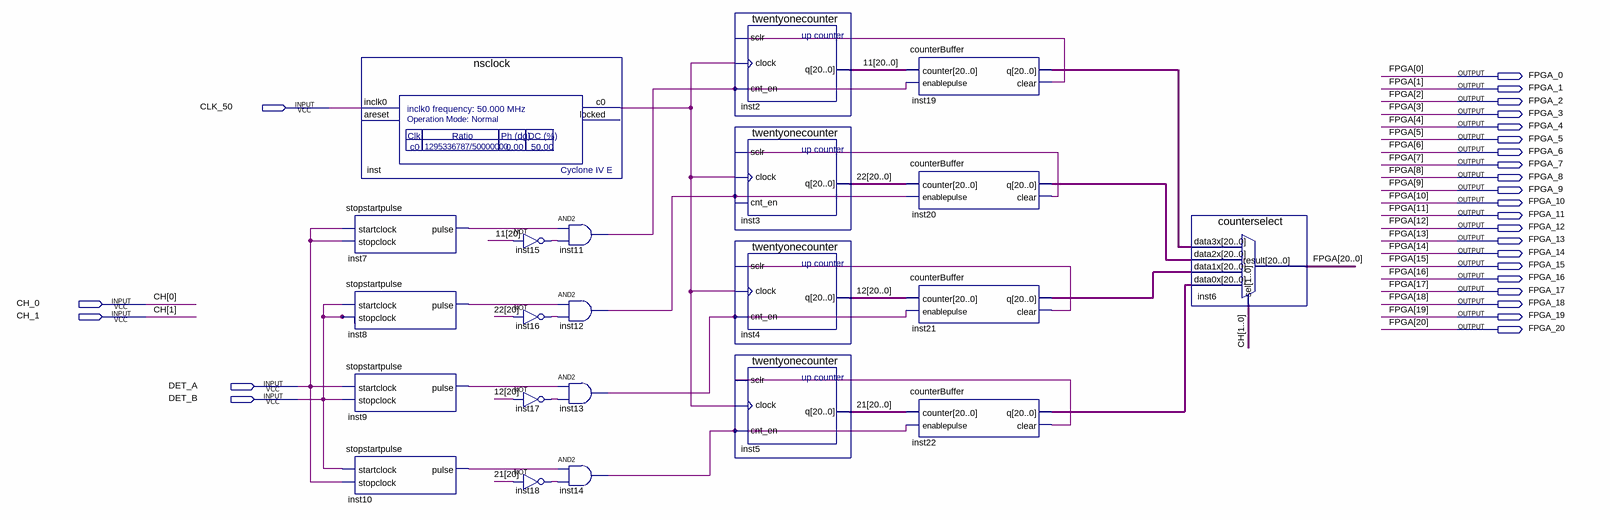
[diagram p0: schematic sheet]
// Quartus schematic timedifferencehist.bdf as structural Verilog: 22 symbols, 26 pins
module timedifferencehist (
  input  CLK_50,
  input  CH_0,
  input  CH_1,
  input  DET_A,
  input  DET_B,
  output FPGA_0,
  output FPGA_1,
  output FPGA_2,
  output FPGA_3,
  output FPGA_4,
  output FPGA_5,
  output FPGA_6,
  output FPGA_7,
  output FPGA_8,
  output FPGA_9,
  output FPGA_10,
  output FPGA_11,
  output FPGA_12,
  output FPGA_13,
  output FPGA_14,
  output FPGA_15,
  output FPGA_16,
  output FPGA_17,
  output FPGA_18,
  output FPGA_19,
  output FPGA_20
);

  wire inst7_pulse, inst8_pulse, inst9_pulse, inst10_pulse, inst11_out, inst12_out, inst13_out, inst14_out,
       inst15_out, inst16_out, inst17_out, inst18_out, inst19_clear, inst20_clear, inst21_clear,
       inst22_clear, inst_c0;
  wire [20:0] \11 , \12 , \21 , \22 , inst19_q, inst20_q, inst21_q, inst22_q;

  nsclock inst (.inclk0(CLK_50), .c0(inst_c0));  // open: areset, locked
  stopstartpulse inst7 (.startclock(DET_A), .stopclock(DET_A), .pulse(inst7_pulse));
  stopstartpulse inst8 (.startclock(DET_B), .stopclock(DET_B), .pulse(inst8_pulse));
  stopstartpulse inst9 (.startclock(DET_A), .stopclock(DET_B), .pulse(inst9_pulse));
  stopstartpulse inst10 (.startclock(DET_B), .stopclock(DET_A), .pulse(inst10_pulse));
  not inst15 (inst15_out, \11 [20]);
  not inst16 (inst16_out, \22 [20]);
  not inst17 (inst17_out, \12 [20]);
  not inst18 (inst18_out, \21 [20]);
  and inst11 (inst11_out, inst7_pulse, inst15_out);
  and inst12 (inst12_out, inst8_pulse, inst16_out);
  and inst13 (inst13_out, inst9_pulse, inst17_out);
  and inst14 (inst14_out, inst10_pulse, inst18_out);
  twentyonecounter inst2 (.sclr(inst19_clear), .clock(inst_c0), .cnt_en(inst11_out), .q(\11 ));
  twentyonecounter inst3 (.sclr(inst20_clear), .clock(inst_c0), .cnt_en(inst12_out), .q(\22 ));
  twentyonecounter inst4 (.sclr(inst21_clear), .clock(inst_c0), .cnt_en(inst13_out), .q(\12 ));
  twentyonecounter inst5 (.sclr(inst22_clear), .clock(inst_c0), .cnt_en(inst14_out), .q(\21 ));
  counterBuffer inst19 (.counter(\11 ), .enablepulse(inst11_out), .q(inst19_q), .clear(inst19_clear));
  counterBuffer inst20 (.counter(\22 ), .enablepulse(inst12_out), .q(inst20_q), .clear(inst20_clear));
  counterBuffer inst21 (.counter(\12 ), .enablepulse(inst13_out), .q(inst21_q), .clear(inst21_clear));
  counterBuffer inst22 (.counter(\21 ), .enablepulse(inst14_out), .q(inst22_q), .clear(inst22_clear));
  counterselect inst6 (
    .data3x(inst19_q), .data2x(inst20_q), .data1x(inst21_q), .data0x(inst22_q), .sel({CH_1, CH_0}),
    .result({FPGA_20, FPGA_19, FPGA_18, FPGA_17, FPGA_16, FPGA_15, FPGA_14, FPGA_13, FPGA_12, FPGA_11, FPGA_10, FPGA_9, FPGA_8, FPGA_7, FPGA_6, FPGA_5, FPGA_4, FPGA_3, FPGA_2, FPGA_1, FPGA_0}));

  // Other names for the same wires on the sheet: CH[1:0] = {CH_1, CH_0};
  //   FPGA[20:0] = {FPGA_20, FPGA_19, FPGA_18, FPGA_17, FPGA_16, FPGA_15, FPGA_14, FPGA_13, FPGA_12, FPGA_11, FPGA_10, FPGA_9, FPGA_8, FPGA_7, FPGA_6, FPGA_5, FPGA_4, FPGA_3, FPGA_2, FPGA_1, FPGA_0}
endmodule
